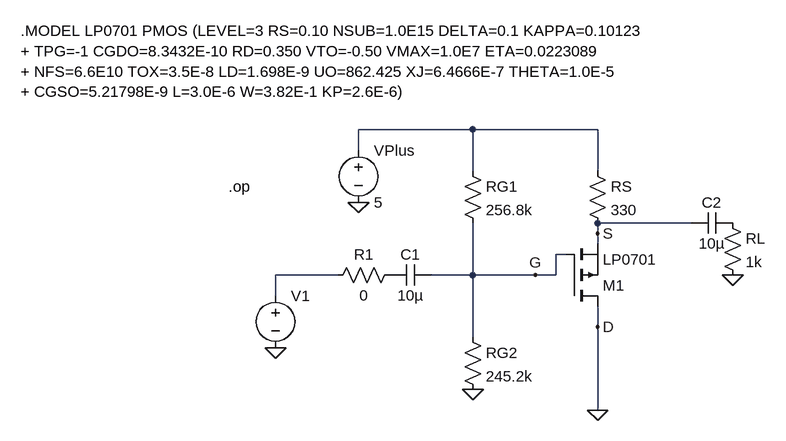
[diagram p0: schematic 3_2_a.asc]
3_2_a.asc, the LTspice schematic file:
Version 4.1
SHEET 1 880 680
WIRE 240 16 64 16
WIRE 432 16 240 16
WIRE 64 48 64 16
WIRE 240 80 240 16
WIRE 432 80 432 16
WIRE 576 160 432 160
WIRE 432 176 432 160
WIRE 432 192 432 176
WIRE 384 208 368 208
WIRE 32 240 -64 240
WIRE 240 240 240 160
WIRE 240 240 176 240
WIRE 336 240 240 240
WIRE 368 240 368 208
WIRE 368 240 336 240
WIRE -64 272 -64 240
WIRE 432 320 432 288
WIRE 240 336 240 240
WIRE 432 448 432 320
FLAG 64 128 0
FLAG -64 352 0
FLAG 240 416 0
FLAG 432 448 0
FLAG 640 240 0
FLAG 432 176 S
FLAG 336 240 G
FLAG 432 320 D
SYMBOL voltage 64 32 R0
SYMATTR InstName VPlus
SYMATTR Value 5
SYMBOL voltage -64 256 R0
WINDOW 3 24 100 Left 2
WINDOW 123 24 72 Left 2
WINDOW 39 0 0 Left 0
SYMATTR InstName V1
SYMATTR Value ""
SYMBOL res 224 64 R0
SYMATTR InstName RG1
SYMATTR Value 256.8k
SYMBOL res 224 320 R0
SYMATTR InstName RG2
SYMATTR Value 245.2k
SYMBOL res 416 64 R0
SYMATTR InstName RS
SYMATTR Value 330
SYMBOL res 624 144 R0
SYMATTR InstName RL
SYMATTR Value 1k
SYMBOL res 128 224 R90
WINDOW 0 0 56 VBottom 2
WINDOW 3 32 56 VTop 2
SYMATTR InstName R1
SYMATTR Value 0
SYMBOL cap 176 224 R90
WINDOW 0 0 32 VBottom 2
WINDOW 3 32 32 VTop 2
SYMATTR InstName C1
SYMATTR Value 10µ
SYMBOL cap 640 144 R90
WINDOW 0 0 32 VBottom 2
WINDOW 3 32 32 VTop 2
SYMATTR InstName C2
SYMATTR Value 10µ
SYMBOL pmos 384 288 M180
SYMATTR InstName M1
SYMATTR Value LP0701
TEXT -136 104 Left 2 !.op
TEXT -456 -136 Left 2 !.MODEL LP0701 PMOS (LEVEL=3 RS=0.10 NSUB=1.0E15 DELTA=0.1 KAPPA=0.10123\n+ TPG=-1 CGDO=8.3432E-10 RD=0.350 VTO=-0.50 VMAX=1.0E7 ETA=0.0223089\n+ NFS=6.6E10 TOX=3.5E-8 LD=1.698E-9 UO=862.425 XJ=6.4666E-7 THETA=1.0E-5\n+ CGSO=5.21798E-9 L=3.0E-6 W=3.82E-1 KP=2.6E-6)

The netlist it stands for:
* 3_2_a.asc
VPlus N001 0 5
V1 N002 0
RG1 N001 G 256.8k
RG2 G 0 245.2k
RS N001 S 330
RL P001 0 1k
R1 P002 N002 0
C1 G P002 10µ
C2 P001 S 10µ
M1 0 G S S LP0701
.model NMOS NMOS
.model PMOS PMOS
.lib standard.mos
.op
.MODEL LP0701 PMOS (LEVEL=3 RS=0.10 NSUB=1.0E15 DELTA=0.1 KAPPA=0.10123
+ TPG=-1 CGDO=8.3432E-10 RD=0.350 VTO=-0.50 VMAX=1.0E7 ETA=0.0223089
+ NFS=6.6E10 TOX=3.5E-8 LD=1.698E-9 UO=862.425 XJ=6.4666E-7 THETA=1.0E-5
+ CGSO=5.21798E-9 L=3.0E-6 W=3.82E-1 KP=2.6E-6)
.backanno
.end